# EAGLE design iv-16_ctrl_brd_ (EAGLE 9.6.0)
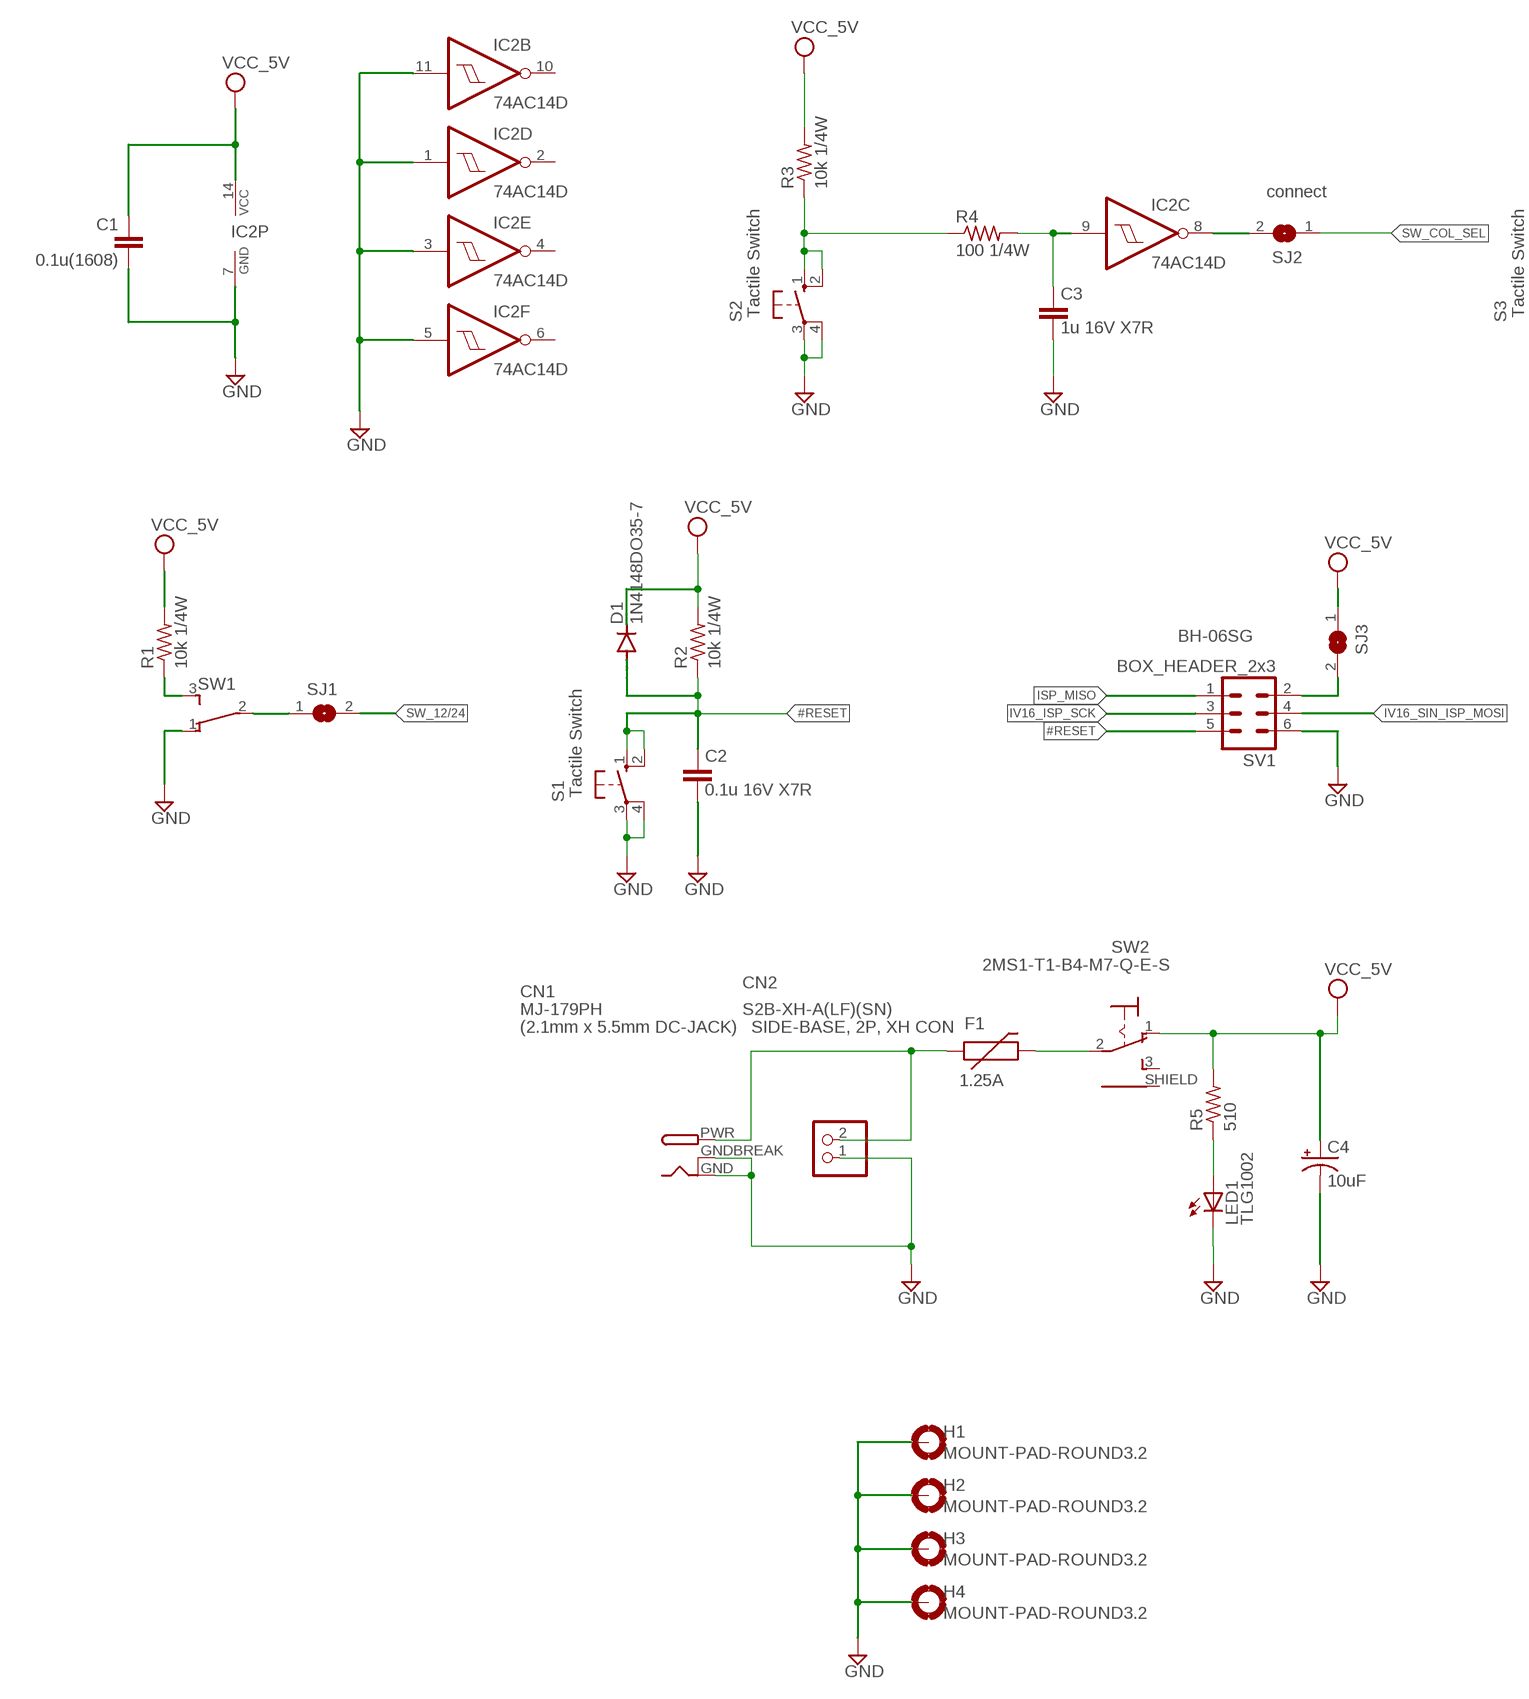
[diagram p0: schematic, sheet 1, part 1 of 2]
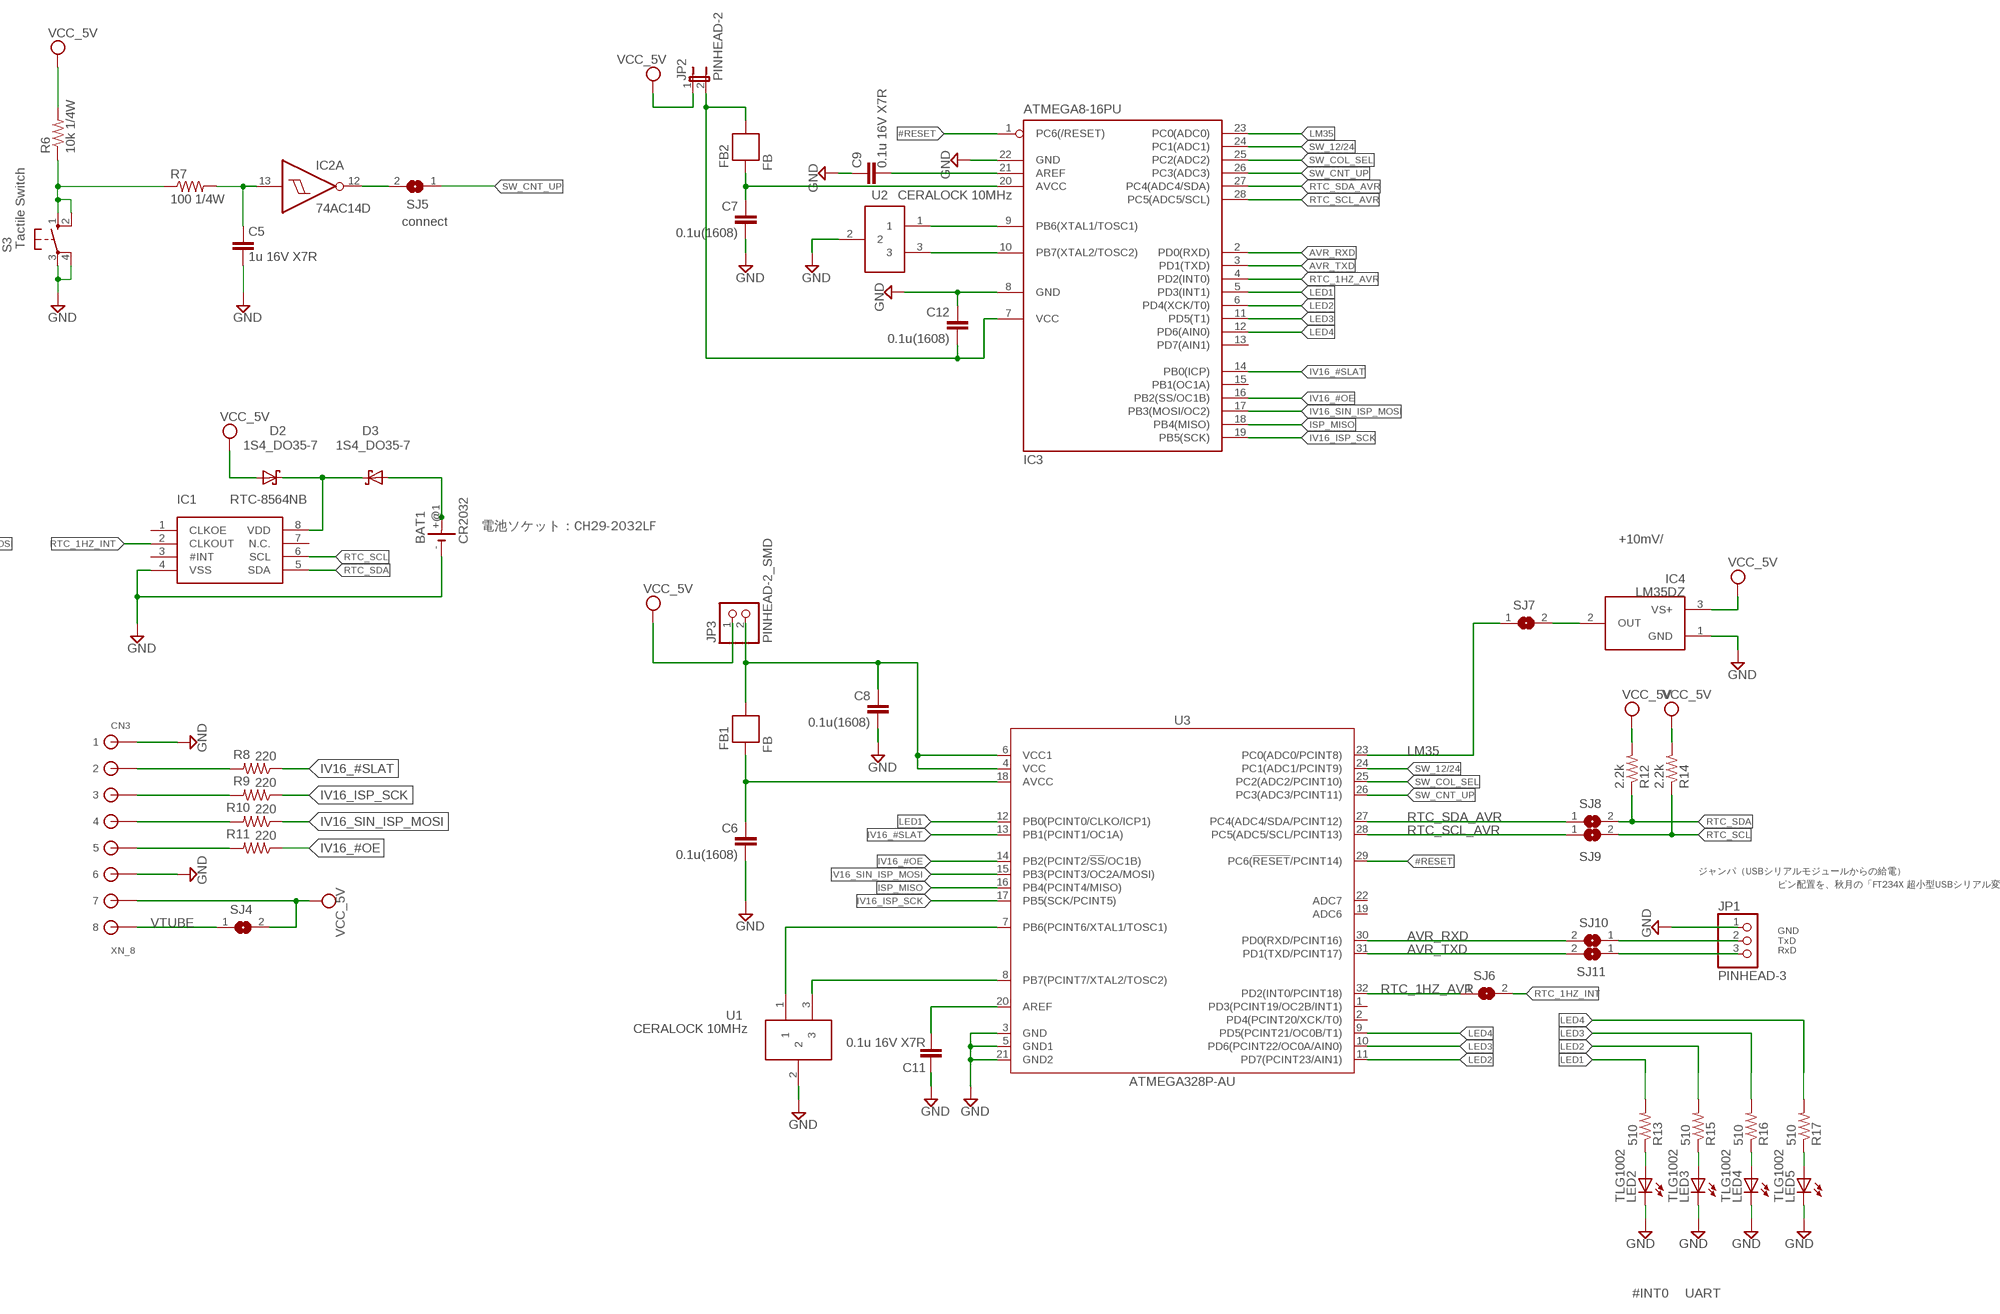
[diagram p1: schematic, sheet 1, part 2 of 2]

## Parts
BAT1  CR2032  CH29-2032LF  [CH29-2032LF]
C1  0.1u(1608)  C-EUC0603  [C0603]
C2  0.1u 16V X7R  C-EUC0603  [C0603]
C3  1u 16V X7R  C-EUC0603  [C0603]
C4  10uF  CPOL-USE2.5-7  [E2,5-7]
C5  1u 16V X7R  C-EUC0603  [C0603]
C6  0.1u(1608)  C-EUC0603  [C0603]
C7  0.1u(1608)  C-EUC0603  [C0603]
C8  0.1u(1608)  C-EUC0603  [C0603]
C9  0.1u 16V X7R  C-EUC0603  [C0603]
C11  0.1u 16V X7R  C-EUC0603  [C0603]
C12  0.1u(1608)  C-EUC0603  [C0603]
CN1  MJ-179PH  DCBARREL  [DCJACK_2MM_THIN_18742]
CN2  S2B-XH-A(LF)(SN)  B2B-XH-A  [B2B-XH-A]
CN3  XN_8  CON8  [CON8]
D1  1N4148DO35-7  [DO35-7]
D2  1S4_DO35-7  1S3_1S4VERTICAL  [0309V]
D3  1S4_DO35-7  1S3_1S4VERTICAL  [0309V]
F1  1.25A  PTCPTH  [PTC]
FB1  FB  [0603]
FB2  FB  [0603]
H1  MOUNT-PAD-ROUND3.2  [3,2-PAD]
H2  MOUNT-PAD-ROUND3.2  [3,2-PAD]
H3  MOUNT-PAD-ROUND3.2  [3,2-PAD]
H4  MOUNT-PAD-ROUND3.2  [3,2-PAD]
IC1  RTC-8564NB  RTC-8564_MODULE  [RTC-8564_MODULE]
IC2  74AC14D  [SO14]
IC3  ATMEGA8-16PU  MEGA8-P  [DIL28-3]
IC4  LM35DZ  LM35  [TO92-LINE]
JP1  PINHEAD-3  PINHD-1X3/90  [1X03/90]
JP2  PINHEAD-2  JP1E  [JP1]
JP3  PINHEAD-2_SMD  PINHD-1X02_2.54-SMD  [1X02SMD]
LED1  TLG1002  LEDCHIPLED_0805  [CHIPLED_0805]
LED2  TLG1002  LEDCHIPLED_0805  [CHIPLED_0805]
LED3  TLG1002  LEDCHIPLED_0805  [CHIPLED_0805]
LED4  TLG1002  LEDCHIPLED_0805  [CHIPLED_0805]
LED5  TLG1002  LEDCHIPLED_0805  [CHIPLED_0805]
R1  10k 1/4W  R-US_R0805  [R0805]
R2  10k 1/4W  R-US_R0805  [R0805]
R3  10k 1/4W  R-US_R0805  [R0805]
R4  100 1/4W  R-US_R0805  [R0805]
R5  510  R-US_0207/10  [0207/10]
R6  10k 1/4W  R-US_R0805  [R0805]
R7  100 1/4W  R-US_R0805  [R0805]
R8  220  R-US_R0603  [R0603]
R9  220  R-US_R0603  [R0603]
R10  220  R-US_R0603  [R0603]
R11  220  R-US_R0603  [R0603]
R12  2.2k  R-US_0309/V  [0309V]
R13  510  R-US_0207/10  [0207/10]
R14  2.2k  R-US_0309/V  [0309V]
R15  510  R-US_0207/10  [0207/10]
R16  510  R-US_0207/10  [0207/10]
R17  510  R-US_0207/10  [0207/10]
S1  Tactile Switch  10-XX  [B3F-10XX]
S2  Tactile Switch  10-XX  [B3F-10XX]
S3  Tactile Switch  10-XX  [B3F-10XX]
SJ1  SJ  [SJ]
SJ2  SJ  [SJ]
SJ3  SJ  [SJ]
SJ4  SJ  [SJ]
SJ5  SJ  [SJ]
SJ6  SJ  [SJ]
SJ7  SJ  [SJ]
SJ8  SJ  [SJ]
SJ9  SJ  [SJ]
SJ10  SJ  [SJ]
SJ11  SJ  [SJ]
SV1  BOX_HEADER_2x3  ML6  [ML6]
SW1  SS-12SDP2  [SS-12SDP2]
SW2  2MS1-T1-B4-M7-Q-E-S  [2MS1-T1-B4-M7-Q-E-S]
U1  CERALOCK 10MHz  CERALOCK  [CERALOCK]
U2  CERALOCK 10MHz  CERALOCK  [CERALOCK]
U3  ATMEGA328P-AU  ATMEGA328-1_TQFP  [TQFP32-08]

## Nets
#RESET: C2.1 D1.A IC3.1(PC6(/RESET)) R2.1 S1.1(S) S1.2(S1) SV1.5 U3.29(PC6(!RESET!/PCINT14))
AVR_RXD: IC3.2(PD0(RXD)) SJ10.2 U3.30(PD0(RXD/PCINT16))
AVR_TXD: IC3.3(PD1(TXD)) SJ11.2 U3.31(PD1(TXD/PCINT17))
GND: BAT1.- C1.2 C2.2 C3.2 C4.- C5.2 C6.2 C7.2 C8.2 C9.1 C11.1 C12.1 CN1.GND CN1.GNDBREAK CN2.1 CN3.P$1 CN3.P$6 H1.B3,2(MOUNT) H2.B3,2(MOUNT) H3.B3,2(MOUNT) H4.B3,2(MOUNT) IC1.4(VSS) IC2.1(D:I) IC2.3(E:I) IC2.5(F:I) IC2.7(P:GND) IC2.11(B:I) IC3.8(GND) IC3.22(GND) IC4.1(GND) JP1.1 LED1.C LED2.C LED3.C LED4.C LED5.C S1.3(P) S1.4(P1) S2.3(P) S2.4(P1) S3.3(P) S3.4(P1) SV1.6 SW1.1(O) U1.2 U2.2 U3.3(GND) U3.5(GND1) U3.21(GND2)
ISP_MISO: IC3.18(PB4(MISO)) SV1.1 U3.16(PB4(PCINT4/MISO))
IV16_#OE: IC3.16(PB2(SS/OC1B)) R11.1 U3.14(PB2(PCINT2/!SS!/OC1B))
IV16_#SLAT: IC3.14(PB0(ICP)) R8.1 U3.13(PB1(PCINT1/OC1A))
IV16_ISP_SCK: IC3.19(PB5(SCK)) R9.1 SV1.3 U3.17(PB5(SCK/PCINT5))
IV16_SIN_ISP_MOSI: IC3.17(PB3(MOSI/OC2)) R10.1 SV1.4 U3.15(PB3(PCINT3/OC2A/MOSI))
LED1: IC3.5(PD3(INT1)) R13.2 U3.12(PB0(PCINT0/CLKO/ICP1))
LED2: IC3.6(PD4(XCK/T0)) R15.2 U3.11(PD7(PCINT23/AIN1))
LED3: IC3.11(PD5(T1)) R16.2 U3.10(PD6(PCINT22/OC0A/AIN0))
LED4: IC3.12(PD6(AIN0)) R17.2 U3.9(PD5(PCINT21/OC0B/T1))
LM35: IC3.23(PC0(ADC0)) SJ7.1 U3.23(PC0(ADC0/PCINT8))
N$1: D2.2(C) D3.2(C) IC1.8(VDD)
N$2: JP1.3 SJ11.1
N$3: JP1.2 SJ10.1
N$4: IC2.12(A:O) SJ5.2
N$5: R6.1 R7.1 S3.1(S) S3.2(S1)
N$6: C5.1 IC2.13(A:I) R7.2
N$7: F1.P$2 SW2.2(2COMM)
N$8: IC2.8(C:O) SJ2.2
N$9: LED3.A R15.1
N$10: IC3.10(PB7(XTAL2/TOSC2)) U2.3
N$11: LED4.A R16.1
N$12: IC4.2(OUT) SJ7.2
N$13: LED5.A R17.1
N$14: SJ3.2 SV1.2
N$15: C9.2 IC3.21(AREF)
N$16: SJ1.1 SW1.2(P)
N$17: C7.1 FB2.2 IC3.20(AVCC)
N$18: C6.1 FB1.2 U3.18(AVCC)
N$19: C3.1 IC2.9(C:I) R4.2
N$20: BAT1.+@1(+) BAT1.+@2(+) D3.1(A)
N$21: R1.1 SW1.3(S)
N$23: C11.2 U3.20(AREF)
N$24: CN1.PWR CN2.2 F1.P$1
N$25: C8.1 FB1.1 JP3.2 U3.4(VCC) U3.6(VCC1)
N$26: LED2.A R13.1
N$27: LED1.A R5.1
N$28: C12.2 FB2.1 IC3.7(VCC) JP2.2
N$29: CN3.P$2 R8.2
N$31: CN3.P$3 R9.2
N$32: CN3.P$4 R10.2
N$33: CN3.P$5 R11.2
N$34: R3.1 R4.1 S2.1(S) S2.2(S1)
N$35: IC3.9(PB6(XTAL1/TOSC1)) U2.1
RTC_1HZ_AVR: IC3.4(PD2(INT0)) SJ6.1 U3.32(PD2(INT0/PCINT18))
RTC_1HZ_INT: IC1.2(CLKOUT) SJ6.2
RTC_SCL: IC1.6(SCL) R14.1 SJ9.2
RTC_SCL_AVR: IC3.28(PC5(ADC5/SCL)) SJ9.1 U3.28(PC5(ADC5/SCL/PCINT13))
RTC_SDA: IC1.5(SDA) R12.1 SJ8.2
RTC_SDA_AVR: IC3.27(PC4(ADC4/SDA)) SJ8.1 U3.27(PC4(ADC4/SDA/PCINT12))
SW_12/24: IC3.24(PC1(ADC1)) SJ1.2 U3.24(PC1(ADC1/PCINT9))
SW_CNT_UP: IC3.26(PC3(ADC3)) SJ5.1 U3.26(PC3(ADC3/PCINT11))
SW_COL_SEL: IC3.25(PC2(ADC2)) SJ2.1 U3.25(PC2(ADC2/PCINT10))
VCC_5V: C1.1 C4.+ CN3.P$7 D1.C D2.1(A) IC2.14(P:VCC) IC4.3(VS+) JP2.1 JP3.1 R1.2 R2.2 R3.2 R5.2 R6.2 R12.2 R14.2 SJ3.1 SJ4.2 SW2.1
VTUBE: CN3.P$8 SJ4.1
XTAL1: U1.1 U3.7(PB6(PCINT6/XTAL1/TOSC1))
XTAL2: U1.3 U3.8(PB7(PCINT7/XTAL2/TOSC2))
Unconnected: IC1.1(CLKOE) IC1.3(#INT) IC1.7(N.C.) IC2.2(D:O) IC2.4(E:O) IC2.6(F:O) IC2.10(B:O) IC3.13(PD7(AIN1)) IC3.15(PB1(OC1A)) SW2.3 SW2.SHIELD U3.1(PD3(PCINT19/OC2B/INT1)) U3.2(PD4(PCINT20/XCK/T0)) U3.19(ADC6) U3.22(ADC7)

## Notes on the sheet
- connect
- connect
- BH-06SG
- 電池ソケット：CH29-2032LF
- +10mV/℃
- (2.1mm x 5.5mm DC-JACK) | SIDE-BASE, 2P, XH CON
- ジャンパ（USBシリアルモジュールからの給電）
- ピン配置を、秋月の「FT234X 超小型USBシリアル変換モジュール」に合わせる
- GND
  TxD
  RxD
- #INT0 | UART

## Library data of the parts
BAT1 = 11MyLib:CH29-2032LF
C1-C3 C5-C9 C11 C12 = 11MyLib:C-EU: CAPACITOR, European symbol
C4 = rcl:CPOL-US: POLARIZED CAPACITOR, American symbol; SPICEPREFIX: C
CN1 = 11MyLib:DCBARREL: 2.0mm DC Barrel Jack DCJACK_2MM_PTH - Through Hole Jack (4UConnector: 05537)
CN2 = jst-xh:B2B-XH-A: Wire-to-Board 2.5mm pitch top mount connector Source: http://www.jst-mfg.com/product/pdf/jpn/XH.pdf http://www.jst-mfg.com/product/detail.php?series=277
CN3 = 1-MyLib:CON8: LOW INSERTION CONNECTOR 8
D1 = diode:1N4148: DIODE high speed (Philips)
D2 D3 = 11MyLib:1S3_1S4: 1S4 - Shottkey Diode ・For use in low voltage, high frequency inverters, free wheeling, and polarity protection applications. ・Package : R-1 Molded plastic ・Terminals : Axial leads, solderable per MIL-STD-750, Method 2026 ・Vf = 0.5V @1A ・If(average) = 1A ・Vdc = Vrm = 40V Documents : datasheet <http://akizukidenshi.com/download/1S4.pdf> You can buy at Akizuki Denshi <http://akizukidenshi.com/catalog/g/gI-00127/> (\30 per piece)
F1 = SparkFun-PowerIC:PTC: Resettable Fuse PTC Resettable Fuse. Spark Fun Electronics SKU : COM-08357
FB1 FB2 = SparkFun-Passives:FB
H1-H4 = holes:MOUNT-PAD-ROUND: MOUNTING PAD, round
IC1 = 11MyLib:RTC-8564_MODULE
IC2 = 74xx-eu:74*14: Hex schmitt trigger INVERTER
IC3 = atmel:MEGA8-P: MICROCONTROLLER 8 Kbytes FLASH, 1 kbytes SRAM, 512 bytes EEPROM, USART, 4-channel 10 bit ADC, 2-channel 8 bit ADC Pin compatible with Atmega48, ATMega88, ATMega168 Source: avr.lbr; OC_FARNELL: unknown; OC_NEWARK: unknown
IC4 = 11MyLib:LM35
JP1 = pinhead:PINHD-1X3: PIN HEADER
JP2 = jumper:JP1E: JUMPER
JP3 = pinhead-2:PINHD-1X02: PIN HEADER
LED1-LED5 = adafruit:LED: LED OSRAM: - CHIPLED LG R971, LG N971, LY N971, LG Q971, LY Q971, LO R971, LY R971 LH N974, LH R974 LS Q976, LO Q976, LY Q976 LO Q996 - Hyper CHIPLED LW Q18S LB Q993, LB Q99A, LB R99A - SideLED LS A670, LO A670, LY A670, LG A670, LP A670 LB A673, LV A673, LT A673, LW A673 LH A674 LY A675 LS A676, LA A676, LO A676, LY A676, LW A676 LS A679, LY A679, LG A679 - Hyper Micro SIDELED® LS Y876, LA Y876, LO Y876, LY Y876 LT Y87S - SmartLED LW L88C, LW L88S LB L89C, LB L89S, LG L890 LS L89K, LO L89K, LY L89K LS L896, LA L896, LO L896, LY L896 - TOPLED LS T670, LO T670, LY T670, LG T670, LP T670 LSG T670, LSP T670, LSY T670, LOP T670, LYG T670 LG T671, LOG T671, LSG T671 LB T673, LV T673, LT T673, LW T673 LH T674 LS T676, LA T676, LO T676, LY T676, LB T676, LH T676, LSB T676, LW T676 LB T67C, LV T67C, LT T67C, LS T67K, LO T67K, LY T67K, LW E67C LS E67B, LA E67B, LO E67B, LY E67B, LB E67C, LV E67C, LT E67C LW T67C LS T679, LY T679, LG T679 LS T770, LO T770, LY T770, LG T770, LP T770 LB T773, LV T773, LT T773, LW T773 LH T774 LS E675, LA E675, LY E675, LS T675 LS T776, LA T776, LO T776, LY T776, LB T776 LHGB T686 LT T68C, LB T68C - Hyper Mini TOPLED® LB M676 - Mini TOPLED Santana® LG M470 LS M47K, LO M47K, LY M47K Source: http://www.osram.convergy.de/
R1-R17 = 11MyLib:R-US_: RESISTOR, American symbol
S1-S3 = switch-omron:10-XX: OMRON SWITCH; MPN: B3F-1000; OC_FARNELL: 176432; OC_NEWARK: 36M3542
SJ1-SJ11 = jumper:SJ: SMD solder JUMPER
SV1 = con-ml:ML6: HARTING; OC_FARNELL: unknown; OC_NEWARK: unknown
SW1 = 11MyLib:SS-12SDP2
SW2 = 11MyLib:2MS1-T1-B4-M7-Q-E-S: Toggle SW Alternate
U1 U2 = ceralock:CERALOCK
U3 = IC_Embedded:ATMEGA328-1: 8-bit AVR Microcontroller with 32K Bytes In-System Programmable Flash Reference: Datasheet <https://www.mouser.com/pdfdocs/Gravitech_ATMEGA328_datasheet.pdf>; CATEGORY: Embedded ICs; CORE: AVR; DATASHEET: https://ww1.microchip.com/downloads/en/DeviceDoc/ATmega48A-PA-88A-PA-168A-PA-328-P-DS-DS40002061B.pdf; DESCRIPTION: AVR AVR® ATmega Microcontroller IC 8-Bit 20MHz 32KB (16K x 16) FLASH 32-TQFP (7x7); IO: 23; MANUFACTURER: Microchip Technology; MPN: ATMEGA328P-AU; OPERATING_TEMPERATURE: -40°C ~ 105°C; PACKAGE_SIZE: 32-TQFP; PACKAGE_TYPE: Surface Mount; PART_STATUS: Active; ROHS: Compliant; SERIES: AVR® ATmega; SPEED: 20MHz; SUBCATEGORY: Microcontrollers; TYPE: 8-Bit

## Board
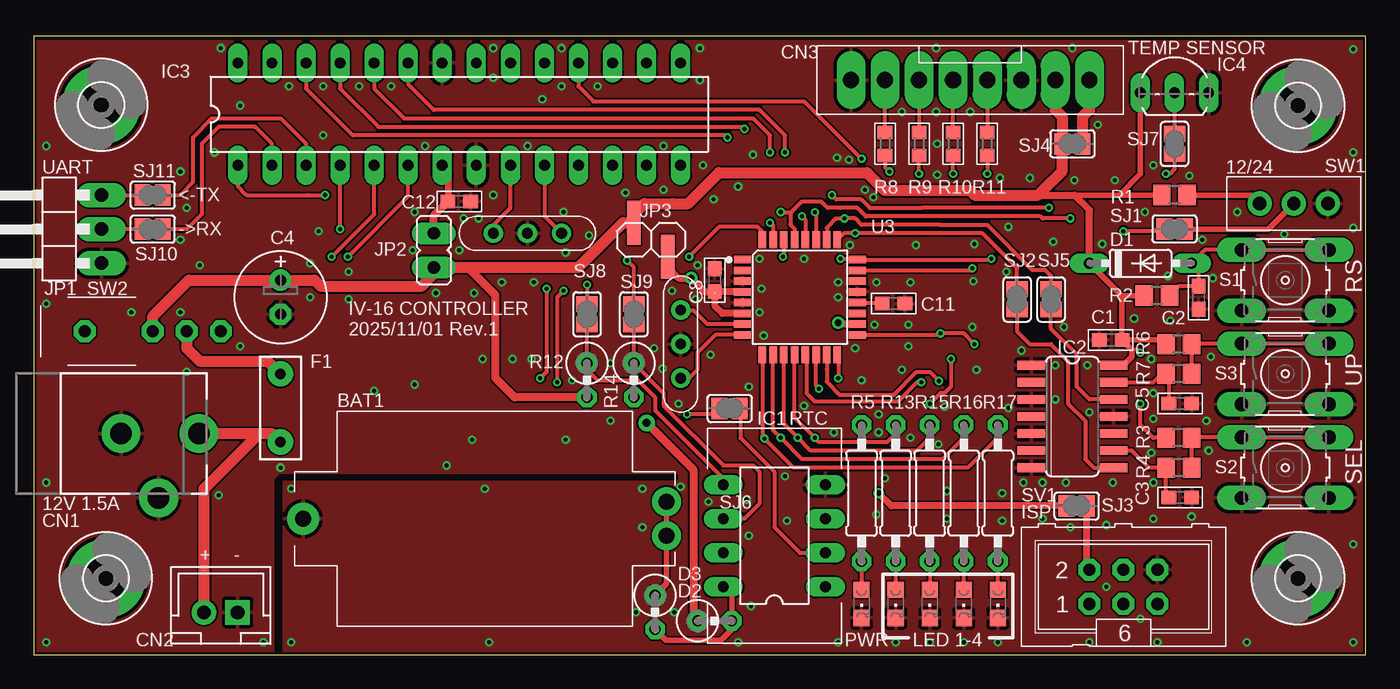
[diagram p2: board, top side]
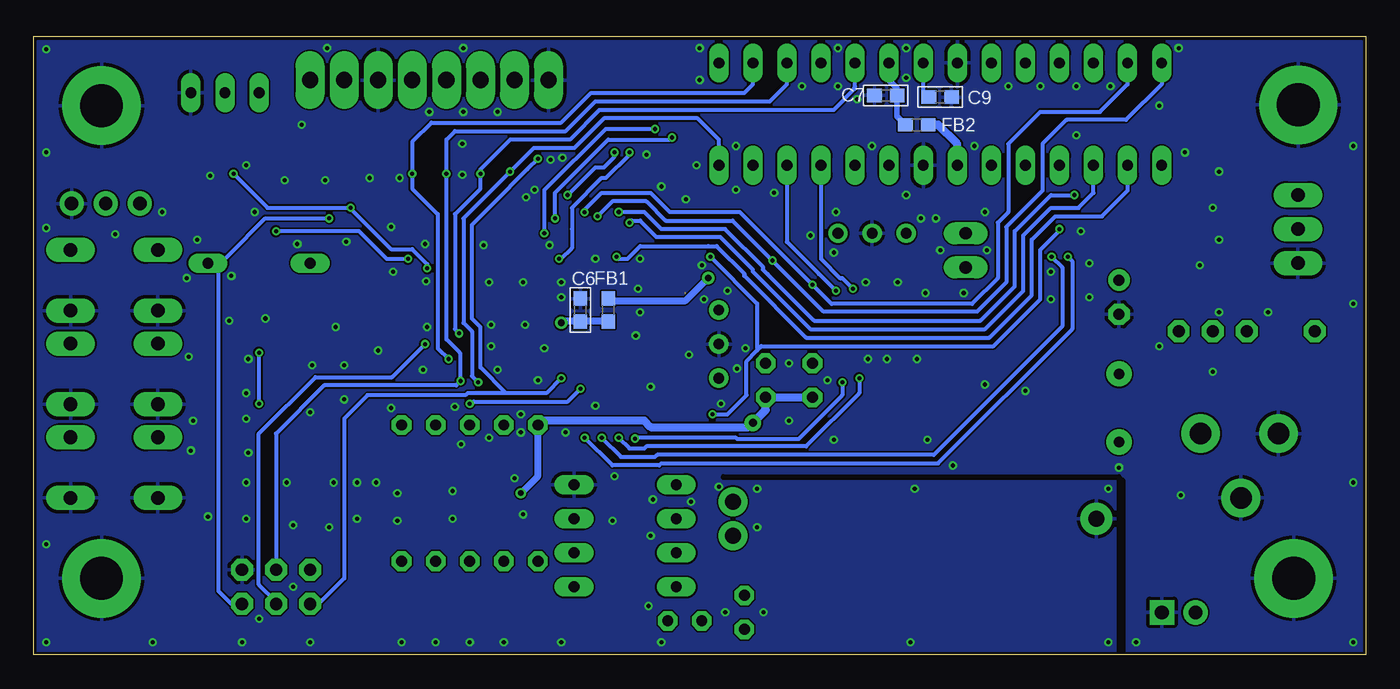
[diagram p3: board, bottom side, seen from below]

Size 99.36 x 46.12 mm. Coordinates in mm from the lower left corner, seen from the top.
Outline: 0,0 99.36,0 99.36,46.12 0,46.12 0,0
Copper layers (1*16): Top 0.035mm / dielectric 1.6mm / Bottom 0.035mm
Design rules "jlcpcb-2layers": minimum track width 5mil, minimum drill 0.3mm, track to track 5mil, track to pad 5mil, pad to pad 5mil, via to via 5mil, smd to smd 5mil, copper to edge 0.2mm, drill to drill 6mil, minimum pad ring 10mil, minimum via ring 3mil, stop-mask expansion 4mil, vias tented up to drill 0mil, thermal gap 10mil
tRestrict: area 18.1,0.3 to 47.9,13.3
bRestrict: area 18.1,0.3 to 47.9,13.3

### Footprints (pad centres in the part's own frame; a part is rotated, then mirrored left to right if it is on the bottom)
CH29-2032LF = drill 1.2 pad 2: +@1 13.55,1.27; +@2 13.55,-1.27 | drill 1.2 pad 2.4: - -13.55,0
C0603 = smd 1.1 x 1: 1 -0.85,0; 2 0.85,0
E2,5-7 = drill 0.813 pad 1.6: + -1.27,0 | drill 0.813 pad 1.6 octagon: - 1.27,0
DCJACK_2MM_THIN_18742 = drill 1.6: GND 0,7.8; GNDBREAK 4.8,10.6; PWR 0,13.6
B2B-XH-A = drill 1.016 square: 1 -1.25,0 | drill 1.016: 2 1.25,0
CON8 = drill 1.2 long: P$1 8.89,0; P$2 6.35,0; P$3 3.81,0; P$4 1.27,0; P$5 -1.27,0; P$6 -3.81,0; P$7 -6.35,0; P$8 -8.89,0
DO35-7 = drill 0.813 long: A 3.81,0; C -3.81,0
0309V = drill 0.813 octagon: 1 -1.27,0; 2 1.27,0
PTC = drill 0.8 pad 1.88: P$1 -2.54,0; P$2 2.54,0
0603 = smd 1.1 x 1: 1 -0.85,0; 2 0.85,0
3,2-PAD = drill 3.2 pad 5.842: B3,2 0,0
RTC-8564_MODULE = drill 0.813 long: 1 -3.81,-3.81; 2 -1.27,-3.81; 3 1.27,-3.81; 4 3.81,-3.81; 5 3.81,3.81; 6 1.27,3.81; 7 -1.27,3.81; 8 -3.81,3.81
SO14 = smd 0.66 x 2.032: 1 -3.81,-3.073; 2 -2.54,-3.073; 3 -1.27,-3.073; 4 0,-3.073; 5 1.27,-3.073; 6 2.54,-3.073; 7 3.81,-3.073; 8 3.81,3.073; 9 2.54,3.073; 10 1.27,3.073; 11 0,3.073; 12 -1.27,3.073; 13 -2.54,3.073; 14 -3.81,3.073
DIL28-3 = drill 0.813 long: 1 -16.51,-3.81; 2 -13.97,-3.81; 3 -11.43,-3.81; 4 -8.89,-3.81; 5 -6.35,-3.81; 6 -3.81,-3.81; 7 -1.27,-3.81; 8 1.27,-3.81; 9 3.81,-3.81; 10 6.35,-3.81; 11 8.89,-3.81; 12 11.43,-3.81; 13 13.97,-3.81; 14 16.51,-3.81; 15 16.51,3.81; 16 13.97,3.81; 17 11.43,3.81; 18 8.89,3.81; 19 6.35,3.81; 20 3.81,3.81; 21 1.27,3.81; 22 -1.27,3.81; 23 -3.81,3.81; 24 -6.35,3.81; 25 -8.89,3.81; 26 -11.43,3.81; 27 -13.97,3.81; 28 -16.51,3.81
TO92-LINE = drill 0.813 long: 1 2.54,0; 2 0,0; 3 -2.54,0
1X03/90 = drill 1.016 long: 1 -2.54,-3.81; 2 0,-3.81; 3 2.54,-3.81
JP1 = drill 0.914 long: 1 0,-1.27; 2 0,1.27
1X02SMD = smd 1.016 x 3.302: 1 -1.27,1.27; 2 1.27,-1.27
CHIPLED_0805 = smd 1.2 x 1.2: A 0,-1.05; C 0,1.05
R0805 = smd 1.3 x 1.5: 1 -0.95,0; 2 0.95,0
0207/10 = drill 0.813 octagon: 1 -5.08,0; 2 5.08,0
R0603 = smd 1 x 1.1: 1 -0.85,0; 2 0.85,0
B3F-10XX = drill 1.016 long: 1 -3.251,2.261; 2 3.251,2.261; 3 -3.251,-2.261; 4 3.251,-2.261
SJ = smd 1.168 x 1.6: 1 -0.762,0; 2 0.762,0
ML6 = drill 0.914 octagon: 1 -2.54,-1.27; 2 -2.54,1.27; 3 0,-1.27; 4 0,1.27; 5 2.54,-1.27; 6 2.54,1.27
SS-12SDP2 = drill 1: 1 2.54,0; 2 0,0; 3 -2.54,0
2MS1-T1-B4-M7-Q-E-S = drill 0.9 octagon: 1 0,0; 2 2.54,0; 3 5.08,0; SHIELD -5.08,0
CERALOCK = drill 0.8: 1 0,0; 2 2.54,0; 3 5.08,0
TQFP32-08 = smd 1.27 x 0.559: 1 -4.293,2.8; 2 -4.293,2; 3 -4.293,1.2; 4 -4.293,0.4; 5 -4.293,-0.4; 6 -4.293,-1.2; 7 -4.293,-2; 8 -4.293,-2.8; 17 4.293,-2.8; 18 4.293,-2; 19 4.293,-1.2; 20 4.293,-0.4; 21 4.293,0.4; 22 4.293,1.2; 23 4.293,2; 24 4.293,2.8 | smd 0.559 x 1.27: 9 -2.8,-4.293; 10 -2,-4.293; 11 -1.2,-4.293; 12 -0.4,-4.293; 13 0.4,-4.293; 14 1.2,-4.293; 15 2,-4.293; 16 2.8,-4.293; 25 2.8,4.293; 26 2,4.293; 27 1.2,4.293; 28 0.4,4.293; 29 -0.4,4.293; 30 -1.2,4.293; 31 -2,4.293; 32 -2.8,4.293

### Placement (x,y rotation side)
BAT1  33.66,10.16 0 top
C1  80.33,23.5 180 top
C2  86.87,26.63 270 top
C3  85.51,11.75 0 top
C4  18.41,26.67 270 top
C5  85.51,18.73 0 top
C6  58.58,25.72 90 bottom
C7  35.81,41.72 180 bottom
C8  50.8,27.94 90 top
C9  31.75,41.59 180 bottom
C11  64.14,26.19 180 top
C12  31.75,33.81 180 top
CN1  -1.27,16.51 270 top
CN2  13.97,3.17 180 top
CN3  69.85,42.86 180 top
D1  82.55,29.21 0 top
D2  50.8,2.54 0 top
D3  46.35,3.17 270 top
F1  18.41,18.41 90 top
FB1  56.52,25.72 270 bottom
FB2  33.5,39.53 180 bottom
H1  5.05,41.01 0 top
H2  5.4,5.71 0 top
H3  94.3,40.96 0 top
H4  94.3,5.71 0 top
IC1  55.24,8.89 90 top
IC2  77.47,17.78 270 top
IC3  31.75,40.32 0 top
IC4  85.09,41.91 0 top
JP1  1.27,31.75 90 top
JP2  29.84,30.16 0 top
JP3  46.04,30.96 0 top
LED1  61.75,3.81 180 top
LED2  64.29,3.81 180 top
LED3  66.83,3.81 180 top
LED4  69.37,3.81 180 top
LED5  71.91,3.81 180 top
R1  85.09,34.29 180 top
R2  83.75,26.8 180 top
R3  85.41,16.19 180 top
R4  85.41,13.97 180 top
R5  61.75,12.06 90 top
R6  85.41,23.18 180 top
R7  85.41,20.95 180 top
R8  63.5,38.1 90 top
R9  66.04,38.1 90 top
R10  68.58,38.1 90 top
R11  71.12,38.1 90 top
R12  41.27,20.48 270 top
R13  64.29,12.06 90 top
R14  44.77,20.48 270 top
R15  66.83,12.06 90 top
R16  69.37,12.06 90 top
R17  71.91,12.06 90 top
S1  93.34,27.94 0 top
S2  93.34,13.97 0 top
S3  93.34,20.95 0 top
SJ1  85.09,31.75 180 top
SJ2  73.34,26.51 270 top
SJ3  77.79,11.11 0 top
SJ4  77.47,38.1 180 top
SJ5  75.88,26.51 270 top
SJ6  51.91,18.38 0 top
SJ7  85.09,38.1 90 top
SJ8  41.27,25.4 270 top
SJ9  44.77,25.4 270 top
SJ10  8.89,31.75 0 top
SJ11  8.89,34.29 0 top
SV1  81.28,5.08 0 top
SW1  93.98,33.66 0 top
SW2  8.89,24.13 0 top
U1  48.26,25.72 270 top
U2  34.29,31.43 0 top
U3  57.15,26.67 0 top

### Tracks (layer width: path | path; a pad name or v marks a point on that pad's centre or on a via)
#RESET  (via drill 0.3 pad 0.61)
  Top 0.305: R2.1 85.39,27.48 C2.1 86.87,28.7 D1.A 87.35,30.2 S1.1 S1.2 | v77.31,32.54 75.25,32.54 75.09,32.7 62.07,32.7 61.44,33.34 60.17,33.34 59.21,33.34 58.74,33.81 57.31,33.81 56.75,33.26 | IC3.1 15.24,34.92 15.88,34.29 20.48,34.29 v21.75,34.29 | U3.29 56.75,31.76 56.43,32.07 56.43,32.94 56.75,33.26 | v55.72,33.02 56.52,33.02 56.75,33.26
  Bottom 0.305: 84.77,29.84 85.57,29.05 85.57,4.76 84.61,3.81 SV1.5 | 84.77,29.84 82.07,32.54 v77.31,32.54 | v55.72,33.02 53.82,33.02 52.55,31.75 47.78,31.75 44.97,28.94 44.97,28.73 44.63,28.39 41.16,24.92 28.76,24.92 26.19,27.49 26.19,31.59 23.5,34.29 v21.75,34.29 | D1.A 85.41,29.21 84.77,29.84
AVR_RXD  (via drill 0.3 pad 0.61)
  Top 0.305: IC3.2 17.78,38.1 16.51,39.37 13.81,39.37 12.54,38.1 12.54,32.86 11.43,31.75 SJ10.2 | U3.30 55.95,29.76 v55.88,29.69
  Bottom 0.305: v55.88,29.69 55.72,29.53 55.09,29.53 54.13,30.48 49.05,30.48 48.42,30.48 46.35,28.42 46.35,28.26 41.75,23.65 28.1,23.65 24.92,26.83 24.92,30.96 23.18,32.7 19.68,32.7 17.78,34.61 IC3.2
AVR_TXD  (via drill 0.3 pad 0.61)
  Top 0.305: SJ11.2 10.92,34.29 11.87,35.24 11.87,38.58 13.3,40.01 18.41,40.01 20.32,38.1 IC3.3 | v54.93,32.23 55.15,32 U3.31
  Bottom 0.305: v54.93,32.23 54.77,32.38 54.13,32.38 52.91,31.16 48.15,31.16 45.72,28.73 45.72,28.57 41.43,24.29 28.42,24.29 25.56,27.15 25.56,31.27 23.5,33.34 21.43,33.34 20.32,34.45 IC3.3
GND  (via drill 0.3 pad 0.61)
  other vias: 54.13,25.56 54.29,27.3 62.87,27.78 65.41,27.78 61.28,22.86 61.75,20.48 46.91,21.35 46.28,22.86 34.29,34.29 32.07,32.54 37.31,27.78 37.15,22.07 23.5,26.51 20.64,26.67 18.41,13.97 30.8,14.13 32.7,16.03 39.69,16.03 43.02,17.46 45.4,9.53 44.93,3.17 47.78,3.17 53.5,3.65 53.34,8.89 50.32,11.43 53.18,11.59 56.2,10 63.5,13.18 57.47,18.57 53.34,20 50.48,22.38 19.05,42.39 21.59,42.39 24.29,42.39 26.67,42.39 21.59,38.73 15.4,40.96 13.49,37.47 11.43,33.34 10.95,36.04 10.95,25.56 7.3,25.56 20.64,29.21 21.27,31.59 31.75,30.16 28.42,33.02 29.21,37.94 36.83,37.94 46.99,37.94 46.99,34.69 53.66,37.31 47.62,27.15 49.53,29.05 54.13,29.53 57.47,29.53 60.01,27.78 60.01,26.67 54.45,23.81 65.25,23.02 65.25,24.61 62.71,24.61 70.01,24.45 72.55,28.57 73.66,22.7 70.33,21.27 72.71,18.41 63.02,17.94 67.47,15.72 75.25,10.16 77.31,9.53 80.01,9.68 62.87,10.48 72.23,10 72.23,12.06 80.01,5.08 83.5,17.62 83.5,19.53 83.34,22.07 78.58,21.59 76.2,19.05 78.74,18.1 76.2,21.59 76.04,30.8 74.3,35.56 77.63,35.4 80.64,35.4 79.69,30.64 84.61,28.26 87.15,30.96 87.95,28.1 82.07,25.08 84.77,24.92 87.79,22.23 87.47,17.46 87.63,15.24 82.87,33.02 83.5,36.51 86.2,35.72 69.85,40.48 67.31,40.48 64.77,40.48 49.69,42.86 39.37,42.39 37.94,41.43 34.29,43.02 13.97,45.24 0.95,37.94 0.95,26.19 0.95,0.95 0.95,12.86 17.14,0.95 19.21,0.95 19.21,12.38 33.66,12.38 33.97,0.95 45.4,12.38 48.26,12.54 56.04,13.34 48.1,18.73 43.02,21.75 40.16,20.48 33.5,22.07 35.72,22.07 34.92,27.78 28.26,30.16 23.5,28.57 25.4,19.68 28.42,20.16 39.69,30 30,26.99 32.86,26.99 10.95,30.96 12.38,29.05 15.4,23.02 11.43,21.11 13.81,11.91 34.29,45.24 39.37,45.24 49.69,45.24 42.07,42.39 67.31,45.24 77.47,45.24 79.38,39.53 72.07,35.56 70.17,30.64 72.71,31.91 76.83,24.45 73.82,12.86 75.25,12.86 80.49,12.86 83.5,12.86 83.34,15.08 82.55,2.7 52.55,0.95 60.01,0.95 64.29,0.95 66.83,0.95 69.37,0.95 71.91,0.95 78.74,0.95 83.82,0.95 90.49,0.95 98.42,0.95 98.42,8.26 86.36,10.32 76.99,12.86 83.5,10.16 68.1,12.22 68.1,10.16 59.69,16.59 63.02,16.59 65.41,16.19 67.94,18.49 64.77,21.27 49.93,36.51 50.72,33.97 52.55,34.92 61.99,34.69 62.63,34.13 59.93,37.07 60.8,36.91 67.39,38.1 67.39,35.8 60.88,30.56 65.8,30.56 70.09,27.86 89.77,33.02 93.27,31.35 98.42,45.16 98.42,37.47 98.42,31.83 33.18,32.54 41.43,31.27 39.53,33.02 44.13,34.45 49.37,26.51
  pour Top: 0.32,45.72 0.32,0.32 99.06,0.32 99.06,45.72
  pour Bottom: 0.32,45.72 0.32,0.32 99.06,0.32 99.06,45.72
ISP_MISO  (via drill 0.3 pad 0.61)
  Top 0.305: U3.16 60.01,22.32 v60.01,20.64 | IC3.18 40.64,42.39 41.75,41.27 57.47,41.27 v61.75,36.99
  Bottom 0.305: SV1.1 78.11,3.81 76.2,5.71 76.2,17.62 74.45,19.37 70.48,19.37 67.15,19.37 66.99,19.53 64.14,19.53 | v61.75,36.99 62.55,36.2 65.17,33.58 66.67,32.07 66.67,25.08 66.04,24.45 66.04,21.43 64.14,19.53 | v60.01,20.64 61.12,19.53 64.14,19.53
IV16_#OE  (via drill 0.3 pad 0.61)
  Top 0.305: R11.1 v71.12,35.88 | v68.42,22.07 68.42,20 67.94,19.53 67.63,19.53 v66.83,18.73 | v58.58,19.84 58.35,20.07 U3.14
  Bottom 0.305: IC3.16 45.72,42.55 46.35,41.91 57.78,41.91 60.01,39.69 69.69,39.69 71.12,38.26 v71.12,35.88 71.12,34.77 69.22,32.86 69.22,22.86 v68.42,22.07 | v66.83,18.73 66.67,18.73 66.52,18.89 59.53,18.89 v58.58,19.84
IV16_#SLAT  (via drill 0.3 pad 0.61)
  Top 0.305: R8.1 63.5,36.35 v63.82,36.04 | U3.13 57.63,22.3 57.63,19.53 58.26,18.89 64.45,18.89 65.88,20.32 v66.2,20.32
  Bottom 0.305: IC3.14 48.26,38.42 49.85,40.01 56.83,40.01 59.05,37.78 62.07,37.78 v63.82,36.04 67.31,32.54 67.31,24.77 66.67,24.13 66.67,20.8 v66.2,20.32
IV16_ISP_SCK  (via drill 0.3 pad 0.61)
  Top 0.305: v66.04,35.88 R9.1 | U3.17 67.53,23.87 v67.63,23.97 69.37,23.97 v70.17,23.18
  Bottom 0.305: SV1.3 81.28,3.97 82.56,5.25 82.56,16.5 78.34,20.72 72.63,20.72 v70.17,23.18 | IC3.19 38.1,42.36 38.13,42.34 38.13,42.2 39.69,40.64 57.15,40.64 59.37,38.42 63.82,38.42 66.04,36.2 v66.04,35.88 66.04,34.77 67.94,32.86 67.94,24.29 v67.63,23.97
IV16_SIN_ISP_MOSI  (via drill 0.3 pad 0.61)
  Top 0.305: U3.15 59.15,21.27 59.15,20.38 60.12,19.42 64.15,19.42 65.8,21.06 66.89,21.06 v67.52,20.43 | v68.58,35.88 R10.1
  Bottom 0.305: SV1.4 81.28,16.51 77.69,20.1 67.85,20.1 v67.52,20.43 67.57,20.48 67.57,22.52 68.58,23.53 v68.58,35.88 68.58,38.42 67.94,39.05 59.69,39.05 57.47,41.27 44.45,41.27 43.18,42.55 IC3.17
LED1  (via drill 0.3 pad 0.61)
  Top 0.305: R13.2 64.29,16.51 63.66,15.88 58.58,15.88 v58.26,16.19 56.75,17.7 U3.12 | IC3.5 25.4,32.86 v22.23,29.69
  Bottom 0.305: v22.23,29.69 21.91,29.37 21.91,24.29 31.91,14.29 52.55,14.29 52.7,14.13 56.2,14.13 v58.26,16.19
LED2  (via drill 0.3 pad 0.61)
  Top 0.305: R15.2 66.83,16.19 65.88,15.24 57.94,15.24 v56.99,16.19 55.95,17.23 U3.11 | v23.44,29.69 27.94,34.18 IC3.6
  Bottom 0.305: v56.99,16.19 55.56,14.76 53.02,14.76 52.86,14.92 32.23,14.92 22.65,24.5 22.65,28.89 v23.44,29.69
LED3  (via drill 0.3 pad 0.61)
  Top 0.305: R16.2 69.37,16.19 67.79,14.61 57.31,14.61 v55.72,16.19 55.15,16.76 U3.10 | v38.26,27.3 38.26,21.11 v37.78,20.64
  Bottom 0.305: IC3.11 40.64,29.53 39.21,28.1 39.05,28.1 v38.26,27.3 | v55.72,16.19 54.93,15.4 53.82,15.4 53.66,15.56 41.75,15.56 37.78,19.53 v37.78,20.64
LED4  (via drill 0.3 pad 0.61)
  Top 0.305: R17.2 71.91,16.19 69.69,13.97 56.67,13.97 v54.51,16.14 54.35,16.29 U3.9 | v39.53,27.15 39.05,26.67 v39.05,20.32
  Bottom 0.305: IC3.12 43.18,30.8 40.8,28.42 v39.53,27.15 | v54.51,16.14 54.45,16.19 46.98,16.19 46.88,16.1 42.32,16.1 39.05,19.37 v39.05,20.32
LM35  (via drill 0.3 pad 0.61)
  Top 0.305: SJ7.1 85.09,36.2 84.77,35.88 v84.45,35.88 | IC3.23 27.94,42.55 29.84,40.64 54.13,40.64 56.04,38.73 v56.04,37.47 | v75.72,33.34 66.2,33.34 62.36,33.34 61.73,33.97 59.85,33.97 v59.53,34.29 | U3.23 69.85,28.67 v70.01,28.83
  Bottom 0.305: v84.45,35.88 81.92,33.34 v75.72,33.34 75.72,33.27 72.71,30.26 71.12,30.26 70.01,29.15 v70.01,28.83 | v59.53,34.29 57.47,36.35 56.83,36.35 56.04,37.15 v56.04,37.47
N$1
  Top 0.406: D3.2 47.15,1.11 51.28,1.11 52.07,1.91 D2.2 52.07,4.45 IC1.8
N$2
  Top 0.305: JP1.3 SJ11.1
N$3
  Top 0.305: SJ10.1 JP1.2
N$4
  Top 0.305: IC2.12 78.74,19.05 77.79,20 77.79,22.42 75.88,24.32 SJ5.2
N$5
  Top 0.305: 86.4,23.22 R6.1 | S3.2 S3.1 86.4,23.22 | R6.1 R7.1 | 86.4,23.22 R6.1
N$6
  Top 0.305: C5.1 84.66,20.75 R7.2 84.14,20.95 83.5,20.32 IC2.13
N$7
  Top 0.813: SW2.2 11.43,22.86 12.38,21.91 17.46,21.91 F1.P$2
N$8
  Top 0.305: SJ2.2 73.34,24.13 74.3,23.18 75.88,23.18 77.15,21.91 77.15,18.73 78.42,17.46 78.42,14.61 79.06,13.97 IC2.8
N$9
  Top 0.305: R15.1 LED3.A
N$10
  Top 0.305: IC3.10 38.1,32.7 U2.3
N$11
  Top 0.305: LED4.A R16.1
N$12
  Top 0.305: IC4.2 SJ7.2
N$13
  Top 0.305: LED5.A R17.1
N$14
  Top 0.508: SV1.2 78.55,6.54 SJ3.2
N$15
  Bottom 0.305: C9.2 33.02,42.01 IC3.21
N$16
  Top 0.406: SJ1.1 92.08,31.75 SW1.2
N$17
  Bottom 0.406: IC3.20 35.56,42.86 34.96,42.27 C7.1 34.96,40.15 FB2.2
N$18  (via drill 0.51 pad 0.91)
  Top 0.508: U3.18 60.1,24.67 v60.01,24.77
  Bottom 0.508: FB1.2 C6.1 59.91,24.87 v60.01,24.77
N$19
  Top 0.305: 84.45,11.95 C3.1 84.45,11.95 | IC2.9 81.92,15.24 83.19,13.97 R4.2 84.45,11.95
N$20
  Top 0.406: D3.1 47.2,5.29 BAT1.+@2 BAT1.+@1
N$21
  Top 0.406: R1.1 90.81,34.29 SW1.3
N$23
  Top 0.305: U3.20 63.28,26.27 C11.2
N$24
  Top 0.813: CN1.PWR 15.88,16.51 16.99,16.51 | CN2.2 12.72,12.4 16.83,16.51 16.99,16.51 | F1.P$1 17.78,16.51 16.99,16.51
N$25  (via drill 0.51 pad 0.91)  (1 unrouted)
  Top 0.406: 50.82,26.94 50.63,27.13 50.63,27.12 | 50.73,27.16 C8.1
  Top 0.508: 50.82,27.07 C8.1 | U3.6 51.37,25.47 50.8,26.04 C8.1 | 50.8,26.93 50.82,26.94 | JP3.2 47.31,28.89 48.1,28.1 v49.05,28.1 50.08,27.07 50.82,27.07 | U3.4 50.82,27.07 | C8.1 50.66,27.09 50.73,27.16 C8.1 | 50.8,27.05 50.82,27.07
  Top 0.61: JP3.2 47.47,29.53 47.47,28.89
  Bottom 0.508: FB1.1 56.36,26.41 50.74,26.41 v49.05,28.1
N$26
  Top 0.305: LED2.A R13.1
N$27
  Top 0.305: R5.1 LED1.A
N$28
  Top 0.508: IC3.7 30.9,36.09 C12.2
  Top 0.61: JP2.2 29.84,32.76 C12.2
  Bottom 0.61: IC3.7 30.48,38.1 31.91,39.53 FB2.1
N$29
  Top 0.305: R8.2 CN3.P$2
N$31
  Top 0.305: CN3.P$3 R9.2
N$32
  Top 0.305: R10.2 CN3.P$4
N$33
  Top 0.305: CN3.P$5 R11.2
N$34
  Top 0.305: S2.2 S2.1 86.39,16.23 R3.1 R4.1
N$35
  Top 0.305: IC3.9 35.56,33.34 34.29,32.07 U2.1
RTC_1HZ_AVR  (via drill 0.3 pad 0.61)
  Top 0.305: v22.86,31.75 IC3.4 | U3.32 54.35,31.53 53.98,31.91 51.12,31.91 v48.9,29.69 | SJ6.1 50.7,17.94 v48.74,17.94
  Bottom 0.305: v22.86,31.75 22.86,31.62 24.29,30.2 24.29,26.51 27.15,23.65 27.78,23.02 45.09,23.02 45.4,22.7 | 45.4,22.7 46.2,21.91 46.2,19.37 47.62,17.94 v48.74,17.94 | v48.9,29.69 45.4,26.19 45.4,22.7
RTC_1HZ_INT
  Top 0.305: SJ6.2 52.7,18.35 52.7,16.19 55.24,13.65 55.24,9.53 57.15,7.62 IC1.2
RTC_SCL
  Top 0.305: SJ9.2 R14.1 46.99,19.53 46.99,18.57 51.44,14.13 53.66,14.13 54.13,13.65 54.13,11.27 53.02,10.16 IC1.6
RTC_SCL_AVR  (via drill 0.3 pad 0.61)
  Top 0.305: SJ9.1 44.77,28.89 v44.25,29.41 | v57.31,32.7 57.55,32.46 U3.28
  Bottom 0.305: IC3.28 15.24,42.55 17.89,39.89 22.34,39.89 24.13,38.1 24.13,34.61 26.83,31.91 26.83,27.78 29.01,25.6 40.44,25.6 v44.25,29.41 47.23,32.38 52.23,32.38 53.66,33.81 56.2,33.81 v57.31,32.7
RTC_SDA
  Top 0.305: SJ8.2 R12.1 41.27,21.27 42.07,20.48 45.09,20.48 46.35,19.21 46.35,18.26 51.28,13.34 51.28,12.86 IC1.5
RTC_SDA_AVR  (via drill 0.3 pad 0.61)
  Top 0.305: SJ8.1 41.27,27.6 v41.29,27.61 | v58.27,33.02 58.35,32.93 U3.27
  Bottom 0.305: v58.27,33.02 58.27,33.17 56.99,34.45 53.34,34.45 51.91,33.02 46.7,33.02 v41.29,27.61 39.86,26.18 29.38,26.18 27.46,28.1 27.46,32.23 26.67,33.02 26.67,38.1 24.29,40.48 19.84,40.48 17.78,42.55 IC3.27
SW_12/24  (via drill 0.3 pad 0.61)
  Top 0.305: v71.44,29.53 71.44,29.47 U3.24 61.38,29.53 v60.17,29.53 | SJ1.2 84.17,31.59 v81.28,31.59 | v54.93,37.47 54.93,38.73 53.66,40.01 27.62,40.01 25.4,42.23 IC3.24
  Bottom 0.305: v71.44,29.53 73.03,29.53 75.09,31.59 v81.28,31.59 | v54.93,37.47 54.93,37.31 56.67,35.56 56.99,35.56 59.21,33.34 59.21,31.75 59.21,30.32 60.01,29.53 v60.17,29.53
SW_CNT_UP  (via drill 0.3 pad 0.61)
  Top 0.305: IC3.26 20.32,42.23 23.81,38.73 51.59,38.73 v51.75,38.58 | SJ5.1 75.88,28.26 75.41,28.73 74.45,28.73 71.12,32.07 67.63,32.07 61.75,32.07 61.28,32.54 v60.48,32.54 59.85,32.54 59.15,31.84 U3.26
  Bottom 0.305: v60.48,32.54 60.48,34.45 56.52,38.42 51.91,38.42 v51.75,38.58
SW_COL_SEL  (via drill 0.3 pad 0.61)
  Top 0.305: IC3.25 22.86,42.23 25.72,39.37 52.86,39.37 v53.02,39.21 | SJ2.1 73.34,28.86 70.77,31.43 v61.28,31.43 60.42,31.43 U3.25
  Bottom 0.305: v61.28,31.43 61.28,34.63 56.69,39.22 53.03,39.22 v53.02,39.21
VCC_5V  (via drill 0.3 pad 0.61, 0.41 pad 0.76, 0.61 pad 1.22)
  Top 0.305: 20.95,27.94 C4.+ | R3.2 83.5,16.19 82.55,17.14 v82.55,18.73 | v82.55,22.54 82.33,22.76 81.92,22.76 | 70.8,34.29 70.17,34.29
  Top 0.406: IC4.3 82.55,35.88 80.96,34.29 80.8,34.29 | C1.1 81.18,26.77 | 81.18,26.77 D1.C | 81.18,26.77 81.2,26.8 R2.2 | C1.1 84.14,23.5 R6.2 | IC2.14 81.28,21.59 81.92,22.23 81.92,22.76 C1.1 | 70.8,34.29 70.17,34.29 | 77.63,34.29 80.8,34.29 | R1.2 80.8,34.29
  Top 0.508: SJ3.1 63.98,11.11 v63.02,12.06 | D1.C 78.74,33.18 77.63,34.29 74.93,34.29 | 49.21,2.86 D2.1
  Top 0.61: R12.2 35.88,19.21 34.45,20.64 34.45,26.83 32.38,28.89 | v45.72,17.3 49.21,13.81 49.21,2.86 | 30.32,28.89 JP2.1 29.84,28.42
  Top 0.813: SW2.1 8.89,25.24 11.59,27.94 C4.+ 20.95,27.94 21.43,27.46 28.89,27.46 29.84,28.42 | CN3.P$7 76.2,40.64 76.71,40.13 SJ4.2 76.71,36.07 75.25,34.61 74.93,34.29 70.17,34.29 69.85,34.61 68.74,34.61 63.5,34.61 62.15,35.96 51.12,35.96 48.82,33.66 47.62,33.66 45.56,33.66 44.77,32.86 JP3.1 43.97,32.23 40.64,28.89 32.38,28.89 30.32,28.89
  Bottom 0.305: v82.55,18.73 v82.55,22.54
  Bottom 0.508: v63.02,12.06 61.75,13.34 R5.2
  Bottom 0.61: R5.2 61.44,17.46 53.82,17.46 53.34,16.99 46.04,16.99 v45.72,17.3 44.77,18.26 R14.2 R12.2
VTUBE
  Top 0.813: CN3.P$8 78.74,40.64 78.23,40.13 SJ4.1
XTAL1
  Top 0.305: U3.7 50.26,24.67 49.21,25.72 U1.1
XTAL2
  Top 0.305: U3.8 50.86,23.87 49.53,22.54 49.53,21.27 48.9,20.64 U1.3

### Text on the board
tPlace: TEMP SENSOR | UART | 12/24 | <-TX | ->RX | RS | IV-16 CONTROLLER / 2025/11/01 Rev.1 | UP | RTC | SEL | 12V 1.5A | ISP | + | - | PWR | LED 1-4